# Altium schematic sheet Fuse_Science_PDB_MCU.SchDoc
size A3; SheetNumber: 4; SheetTotal: 8
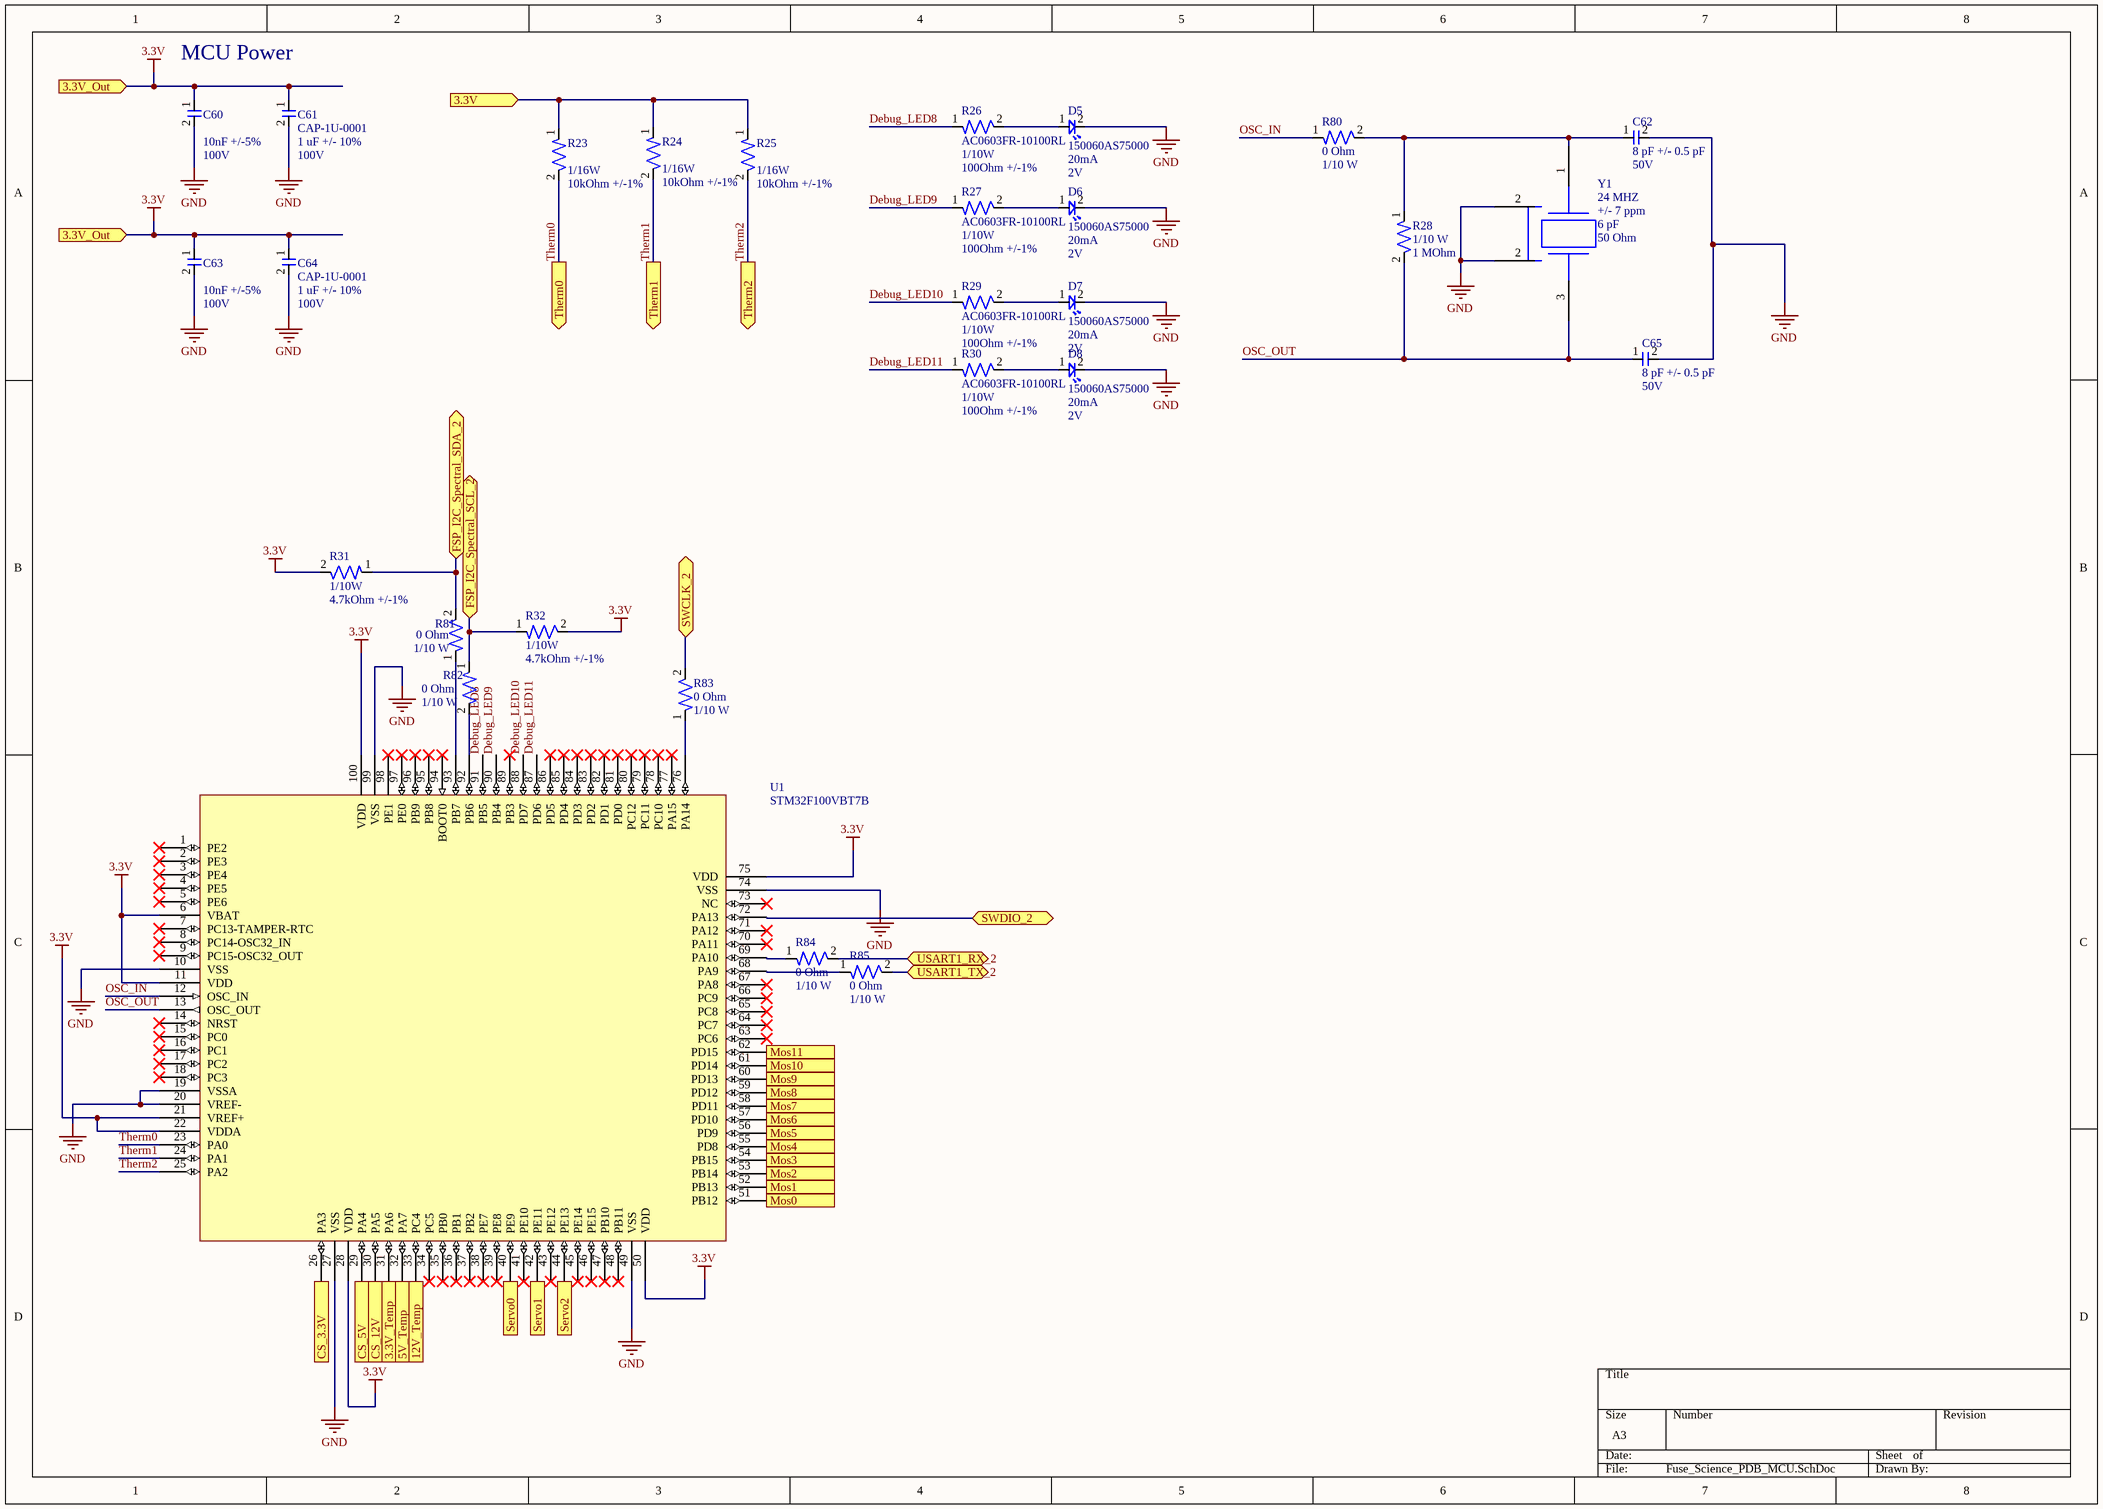
[diagram p0: Fuse_Science_PDB_MCU.SchDoc]

## Parts
C60  Capacitance: 10nF +/-5%  Voltage Rating: 100V  [CAP-0603]  (hidden comment: C1608C0G2A103J080AC)
C61  CAP-1U-0001  Capacitance: 1 uF +/- 10%  Voltage: 100V  [CAP-1206 - duplicate]
C62  Capacitance: 8 pF +/- 0.5 pF  Voltage: 50V  [CAP-0603]  (hidden comment: CC0603DRNPO9BN8R0)
C63  Capacitance: 10nF +/-5%  Voltage Rating: 100V  [CAP-0603]  (hidden comment: C1608C0G2A103J080AC)
C64  CAP-1U-0001  Capacitance: 1 uF +/- 10%  Voltage: 100V  [CAP-1206 - duplicate]
C65  Capacitance: 8 pF +/- 0.5 pF  Voltage: 50V  [CAP-0603]  (hidden comment: CC0603DRNPO9BN8R0)
D5  150060AS75000  Current Rating: 20mA  Vf: 2V  [LED-0603]
D6  150060AS75000  Current Rating: 20mA  Vf: 2V  [LED-0603]
D7  150060AS75000  Current Rating: 20mA  Vf: 2V  [LED-0603]
D8  150060AS75000  Current Rating: 20mA  Vf: 2V  [LED-0603]
R23  Power Rating: 1/16W  Resistance: 10kOhm +/-1%  [RES-0402]  (hidden comment: RC0402FR-0710KL)
R24  Power Rating: 1/16W  Resistance: 10kOhm +/-1%  [RES-0402]  (hidden comment: RC0402FR-0710KL)
R25  Power Rating: 1/16W  Resistance: 10kOhm +/-1%  [RES-0402]  (hidden comment: RC0402FR-0710KL)
R26  AC0603FR-10100RL  Power Rating: 1/10W  Resistance: 100Ohm +/-1%  [RES-0603]
R27  AC0603FR-10100RL  Power Rating: 1/10W  Resistance: 100Ohm +/-1%  [RES-0603]
R28  Power: 1/10 W  Resistance: 1 MOhm  [RES-0603]  (hidden comment: RMCF0603FT1M00)
R29  AC0603FR-10100RL  Power Rating: 1/10W  Resistance: 100Ohm +/-1%  [RES-0603]
R30  AC0603FR-10100RL  Power Rating: 1/10W  Resistance: 100Ohm +/-1%  [RES-0603]
R31  Power Rating: 1/10W  Resistance: 4.7kOhm +/-1%  [RES-0603]  (hidden comment: AF0603FR-074K7L)
R32  Power Rating: 1/10W  Resistance: 4.7kOhm +/-1%  [RES-0603]  (hidden comment: AF0603FR-074K7L)
R80  Resistance: 0 Ohm  Power: 1/10 W  [RES-0603]  (hidden comment: RMCF0603ZT0R00)
R81  Resistance: 0 Ohm  Power: 1/10 W  [RES-0603]  (hidden comment: RMCF0603ZT0R00)
R82  Resistance: 0 Ohm  Power: 1/10 W  [RES-0603]  (hidden comment: RMCF0603ZT0R00)
R83  Resistance: 0 Ohm  Power: 1/10 W  [RES-0603]  (hidden comment: RMCF0603ZT0R00)
R84  Resistance: 0 Ohm  Power: 1/10 W  [RES-0603]  (hidden comment: RMCF0603ZT0R00)
R85  Resistance: 0 Ohm  Power: 1/10 W  [RES-0603]  (hidden comment: RMCF0603ZT0R00)
U1  STM32F100VBT7B  [IC-STM32F100-0001]
Y1  Frequency: 24 MHZ  Frequency Tolerance: +/- 7 ppm  Load Capacitance: 6 pF  Equavalence Series Resistance: 50 Ohm  [CRYSTAL-4-SMD-0001]  (hidden comment: ECS-240-6-37B-7KM-TR)

## Ports
3.3V (in), 3.3V_Out (in), 3.3V_Temp (in), 5V_Temp (in), 12V_Temp (in), CS_3.3V (in), CS_5V (in), CS_12V (in), FSP_I2C_Spectral_SCL_2 (bidir), FSP_I2C_Spectral_SDA_2 (bidir), Mos0 (out), Mos1 (out), Mos2 (out), Mos3 (out), Mos4 (out), Mos5 (out), Mos6 (out), Mos7 (out), Mos8 (out), Mos9 (out), Mos10 (out), Mos11 (out), Servo0 (out), Servo1 (out), Servo2 (out), SWCLK_2 (bidir), SWDIO_2 (bidir), Therm0 (out), Therm1 (out), Therm2 (out), USART1_RX_2 (bidir), USART1_TX_2 (bidir)

## Nets
3.3V: C60.1 C61.1 C63.1 C64.1 R31.2 R32.2 U1.6(VBAT) U1.11(VDD) U1.21(VREF+) U1.22(VDDA) U1.28(VDD) U1.50(VDD) U1.75(VDD) U1.100(VDD) ; port 3.3V_Out
GND: C60.2 C61.2 C62.2 C63.2 C64.2 C65.2 D5.2 D6.2 D7.2 D8.2 U1.10(VSS) U1.19(VSSA) U1.20(VREF-) U1.27(VSS) U1.49(VSS) U1.74(VSS) U1.99(VSS) Y1.2
3.3V: R23.1 R24.1 R25.1 ; port 3.3V  [a separate net that carries the same name]
3.3V_Temp: U1.31(PA6) ; port 3.3V_Temp
5V_Temp: U1.32(PA7) ; port 5V_Temp
12V_Temp: U1.33(PC4) ; port 12V_Temp
CS_3.3V: U1.26(PA3) ; port CS_3.3V
CS_5V: U1.29(PA4) ; port CS_5V
CS_12V: U1.30(PA5) ; port CS_12V
Debug_LED8: R26.1 U1.91(PB5)
Debug_LED9: R27.1 U1.90(PB4)
Debug_LED10: R29.1 U1.88(PD7)
Debug_LED11: R30.1 U1.87(PD6)
FSP_I2C_Spectral_SCL_2: R32.1 R82.1 ; port FSP_I2C_Spectral_SCL_2
FSP_I2C_Spectral_SDA_2: R31.1 R81.2 ; port FSP_I2C_Spectral_SDA_2
Mos0: U1.51(PB12) ; port Mos0
Mos1: U1.52(PB13) ; port Mos1
Mos2: U1.53(PB14) ; port Mos2
Mos3: U1.54(PB15) ; port Mos3
Mos4: U1.55(PD8) ; port Mos4
Mos5: U1.56(PD9) ; port Mos5
Mos6: U1.57(PD10) ; port Mos6
Mos7: U1.58(PD11) ; port Mos7
Mos8: U1.59(PD12) ; port Mos8
Mos9: U1.60(PD13) ; port Mos9
Mos10: U1.61(PD14) ; port Mos10
Mos11: U1.62(PD15) ; port Mos11
OSC_IN: R80.1 U1.12(OSC_IN)
OSC_OUT: C65.1 R28.2 U1.13(OSC_OUT) Y1.3
Servo0: U1.40(PE9) ; port Servo0
Servo1: U1.42(PE11) ; port Servo1
Servo2: U1.44(PE13) ; port Servo2
SWCLK_2: R83.2 ; port SWCLK_2
SWDIO_2: U1.72(PA13) ; port SWDIO_2
Therm0: R23.2 U1.23(PA0) ; port Therm0
Therm1: R24.2 U1.24(PA1) ; port Therm1
Therm2: R25.2 U1.25(PA2) ; port Therm2
USART1_RX_2: R84.2 ; port USART1_RX_2
USART1_TX_2: R85.2 ; port USART1_TX_2
NetC62_1: C62.1 R28.1 R80.2 Y1.1
NetD5_1: D5.1 R26.2
NetD6_1: D6.1 R27.2
NetD7_1: D7.1 R29.2
NetD8_1: D8.1 R30.2
NetR81_1: R81.1 U1.93(PB7)
NetR82_2: R82.2 U1.92(PB6)
NetR83_1: R83.1 U1.76(PA14)
NetR84_1: R84.1 U1.69(PA10)
NetR85_1: R85.1 U1.68(PA9)

Not connected (* = marked no-connect by the designer): U1 1(PE2)* 2(PE3)* 3(PE4)* 4(PE5)* 5(PE6)* 7(PC13-TAMPER-RTC)* 8(PC14-OSC32_IN)* 9(PC15-OSC32_OUT)* 14(NRST)* 15(PC0)* 16(PC1)* 17(PC2)* 18(PC3)* 34(PC5)* 35(PB0)* 36(PB1)* 37(PB2)* 38(PE7)* 39(PE8)* 41(PE10)* 43(PE12)* 45(PE14)* 46(PE15)* 47(PB10)* 48(PB11)* 63(PC6)* 64(PC7)* 65(PC8)* 66(PC9)* 67(PA8)* 70(PA11)* 71(PA12)* 73(NC)* 77(PA15)* 78(PC10)* 79(PC11)* 80(PC12)* 81(PD0)* 82(PD1)* 83(PD2)* 84(PD3)* 85(PD4)* 86(PD5)* 89(PB3)* 94(BOOT0)* 95(PB8)* 96(PB9)* 97(PE0)* 98(PE1)*

## Notes on the sheet
- MCU Power

## Library data of the parts
C60 C63 = CAP-10N-0002: CAP CER 10000PF 100V C0G 0603; Manufacturer: TDK Corporation; Temperature Coefficient: C0G/NP0; Assembled?: no; Manufacturer Part Number: C1608C0G2A103J080AC; Package Size: 0603
C61 C64 = CAP-1U-0001: 1 µF ±10% 100V Ceramic Capacitor X7R 1206 (3216 Metric)
C62 C65 = CAP-8P-0001: 8 pF ±0.5pF 50V Ceramic Capacitor C0G, NP0 0603 (1608 Metric); Package Size: 0603
D5-D8 = LED_Amber_0001: CAP CER 0.1UF 100V X7R 0603; Manufacturer: Wurth Electronik; Assembled?: no; Color: Amber; Manufacturer Part Number: 150060AS75000; Package Size: 0603
R23-R25 = RES-10K-0001: RES 10K OHM 1% 1/16W 0402; Manufacturer: YAGEO; Assembled?: no; Manufacturer Part Number: RC0402FR-0710KL; Package Size: 0402
R26 R27 R29 R30 = RES-100-0002: RESISTOR SMD; Manufacturer: YAGEO; Assembled?: no; Manufacturer Part Number: AC0603FR-10100RL; Package Size: 0603
R28 = RES-1M-0001: 1 MOhms ±1% 0.1W, 1/10W Chip Resistor 0603 (1608 Metric) Automotive AEC-Q200 Thick Film; Package Size: 0603
R31 R32 = RES-4.7K-0002: RES SMD 4.7K OHM 1% 1/10W 0603; Manufacturer: YAGEO; Assembled?: no; Manufacturer Part Number: AF0603FR-074K7L; Package Size: 0603
R80-R85 = RES-0-0001: 0 Ohms Jumper 0.1W, 1/10W Chip Resistor 0603 (1608 Metric) Automotive AEC-Q200 Thick Film; Package Size: 0603
U1 = IC-STM32F100-0001: ARM® Cortex®-M3 STM32F1 Microcontroller IC 32-Bit Single-Core 24MHz 128KB (128K x 8) FLASH 100-LQFP (14x14); VCC: 2 ~ 3.6V; Manufacturer Part Number: STM32F100VBT7B; Package Size: 100-LQFP
Y1 = CRYSTAL-24MHz-0001: 24 MHz ±7ppm Crystal 6pF 50 Ohms 4-SMD, No Lead; Manufacturer: ECS Inc.; Manufacturer Part Number: ECS-240-6-37B-7KM-TR; Package Size: 4-SMD